# EAGLE design debug_board_1 (EAGLE 9.6.2)
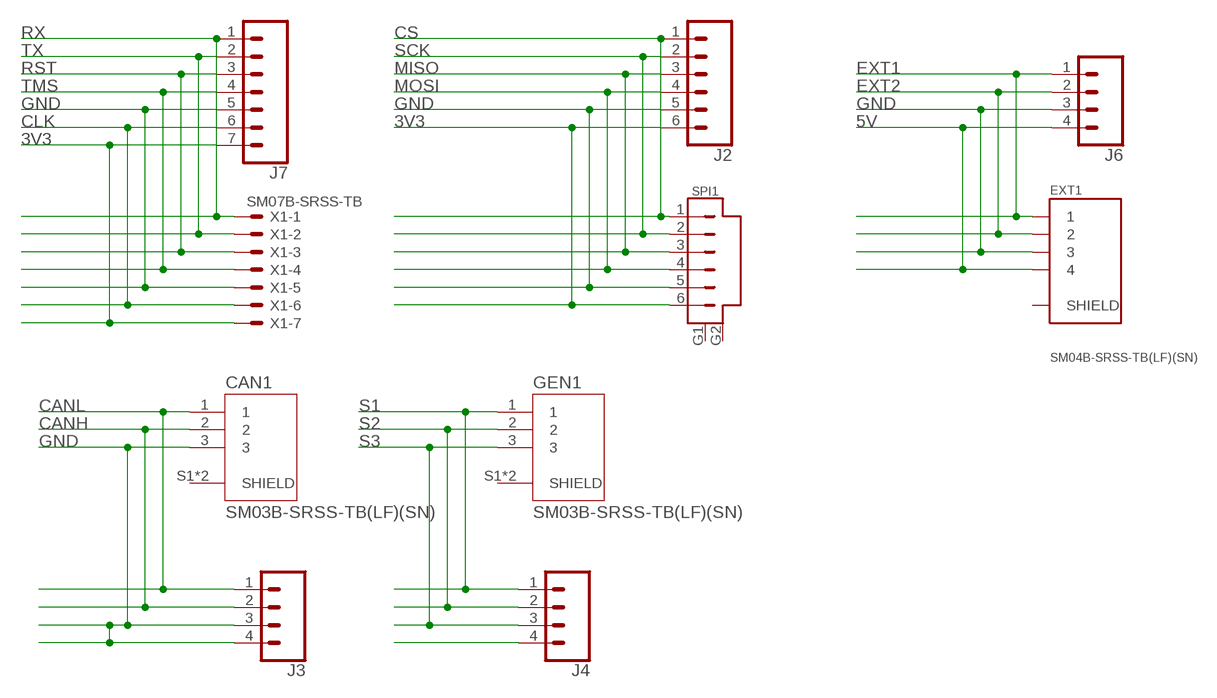
[diagram p0: schematic, sheet 1]

## Parts
CAN1  SM03B-SRSS-TB(LF)(SN)  [JST_SM03B-SRSS-TB(LF)(SN)]
EXT1  SM04B-SRSS-TB(LF)(SN)  [JST_SM04B-SRSS-TB(LF)(SN)]
GEN1  SM03B-SRSS-TB(LF)(SN)  [JST_SM03B-SRSS-TB(LF)(SN)]
J2  CONN_06LONGPADS  [1X06_LONGPADS]
J3  CONN_04LONGPADS  [1X04_LONGPADS]
J4  CONN_04LONGPADS  [1X04_LONGPADS]
J6  CONN_04LONGPADS  [1X04_LONGPADS]
J7  CONN_07LONGPADS  [1X07_LONGPADS]
SPI1  SM06B-SRSS-TB  [SM06B]
X1  SM07B-SRSS-TB  [SM07B-SRSS-TB]

## Nets
3V3: J2.6 J7.7 SPI1.6 X1.7
5V: EXT1.4 J6.4
CANH: CAN1.2 J3.2
CANL: CAN1.1 J3.1
CLK: J7.6 X1.6
CS: J2.1 SPI1.1
EXT1: EXT1.1 J6.1
EXT2: EXT1.2 J6.2
GND: CAN1.3 EXT1.3 J2.5 J3.3 J3.4 J6.3 J7.5 SPI1.5 X1.5
MISO: J2.3 SPI1.3
MOSI: J2.4 SPI1.4
N$45: J4.4
RST: J7.3 X1.3
RX: J7.1 X1.1
S1: GEN1.1 J4.1
S2: GEN1.2 J4.2
S3: GEN1.3 J4.3
SCK: J2.2 SPI1.2
TMS: J7.4 X1.4
TX: J7.2 X1.2
Unconnected: CAN1.S1(SHIELD) CAN1.S2(SHIELD) EXT1.S1(SHIELD) EXT1.S2(SHIELD) GEN1.S1(SHIELD) GEN1.S2(SHIELD) SPI1.G1 SPI1.G2

## Library data of the parts
CAN1 GEN1 = SM03B-SRSS-TB_LF__SN_:SM03B-SRSS-TB(LF)(SN): SH Series 3 Position 1 mm Pitch Surface Mount Side Entry Shrouded Header; AVAILABILITY: Unavailable; DESCRIPTION: Connector Header Surface Mount, Right Angle 3 position 0.039 _1.00mm_; MF: JST Sales; MP: SM03B-SRSS-TB_LF__SN_; PACKAGE: None; PRICE: None
EXT1 = SM04B-SRSS-TB_LF__SN_:SM04B-SRSS-TB(LF)(SN): SH Series 1.0 mm Pitch 2 Position Single Row Side Entry Shrouded Header Check prices <https://snapeda.com/parts/SM04B-SRSS-TB%28LF%29%28SN%29/JST%20Sales/view-part/?ref=eda>; ARROW_EUROPE-PURCHASE-URL: https://snapeda.com/shop?store=Arrow+Europe&id=557466; AVAILABILITY: Good; DESCRIPTION: Connector Header Surface Mount, Right Angle 4 position 0.039 (1.00mm); DIGIKEY-PURCHASE-URL: https://snapeda.com/shop?store=DigiKey&id=557466; MF: JST Sales; MP: SM04B-SRSS-TB(LF)(SN); PACKAGE: None; PRICE: None
J2 = SparkFun-Connectors:CONN_06: Multi connection point. Often used as Generic Header-pin footprint for 0.1 inch spaced/style header connections On any of the 0.1 inch spaced packages, you can populate with these: Break Away Headers - Straight <https://www.sparkfun.com/products/116> (PRT-00116) Break Away Male Headers - Right Angle <https://www.sparkfun.com/products/553> (PRT-00553) Female Headers <https://www.sparkfun.com/products/115> (PRT-00115) Break Away Headers - Machine Pin <https://www.sparkfun.com/products/117> (PRT-00117) Break Away Female Headers - Swiss Machine Pin <https://www.sparkfun.com/products/743> (PRT-00743) Arduino Stackable Header - 6 Pin <https://www.sparkfun.com/products/9280> (PRT-09280) For SCREWTERMINALS and SPRING TERMINALS visit here: Screw Terimnals on SparkFun.com <https://www.sparkfun.com/search/results?term=Screw+Terminals> (5mm/3.5mm/2.54mm spacing) This device is also useful as a general connection point to wire up your design to another part of your project. Our various solder wires solder well into these plated through hole pads. Hook-Up Wire - Assortment (Stranded, 22 AWG) <https://www.sparkfun.com/products/11375> (PRT-11375) Hook-Up Wire - Assortment (Solid Core, 22 AWG) <https://www.sparkfun.com/products/11367> (PRT-11367) View the entire wire category on our website here <https://www.sparkfun.com/categories/141>
J3 J4 J6 = SparkFun-Connectors:CONN_04: Multi connection point. Often used as Generic Header-pin footprint for 0.1 inch spaced/style header connections On any of the 0.1 inch spaced packages, you can populate with these: Break Away Headers - Straight <https://www.sparkfun.com/products/116> (PRT-00116) Break Away Male Headers - Right Angle <https://www.sparkfun.com/products/553> (PRT-00553) Female Headers <https://www.sparkfun.com/products/115> (PRT-00115) Break Away Headers - Machine Pin <https://www.sparkfun.com/products/117> (PRT-00117) Break Away Female Headers - Swiss Machine Pin <https://www.sparkfun.com/products/743> (PRT-00743) For SCREWTERMINALS and SPRING TERMINALS visit here: Screw Terimnals on SparkFun.com <https://www.sparkfun.com/search/results?term=Screw+Terminals> (5mm/3.5mm/2.54mm spacing) This device is also useful as a general connection point to wire up your design to another part of your project. Our various solder wires solder well into these plated through hole pads. Hook-Up Wire - Assortment (Stranded, 22 AWG) <https://www.sparkfun.com/products/11375> (PRT-11375) Hook-Up Wire - Assortment (Solid Core, 22 AWG) <https://www.sparkfun.com/products/11367> (PRT-11367) View the entire wire category on our website here <https://www.sparkfun.com/categories/141> Special notes: Molex polarized connector foot print use with SKU : PRT-08231 with associated crimp pins and housings. 1MM SMD Version SKU: PRT-10208; PROD_ID: CONN-09696
J7 = SparkFun-Connectors:CONN_07: Multi connection point. Often used as Generic Header-pin footprint for 0.1 inch spaced/style header connections On any of the 0.1 inch spaced packages, you can populate with these: Break Away Headers - Straight <https://www.sparkfun.com/products/116> (PRT-00116) Break Away Male Headers - Right Angle <https://www.sparkfun.com/products/553> (PRT-00553) Female Headers <https://www.sparkfun.com/products/115> (PRT-00115) Break Away Headers - Machine Pin <https://www.sparkfun.com/products/117> (PRT-00117) Break Away Female Headers - Swiss Machine Pin <https://www.sparkfun.com/products/743> (PRT-00743) For SCREWTERMINALS and SPRING TERMINALS visit here: Screw Terimnals on SparkFun.com <https://www.sparkfun.com/search/results?term=Screw+Terminals> (5mm/3.5mm/2.54mm spacing) This device is also useful as a general connection point to wire up your design to another part of your project. Our various solder wires solder well into these plated through hole pads. Hook-Up Wire - Assortment (Stranded, 22 AWG) <https://www.sparkfun.com/products/11375> (PRT-11375) Hook-Up Wire - Assortment (Solid Core, 22 AWG) <https://www.sparkfun.com/products/11367> (PRT-11367) View the entire wire category on our website here <https://www.sparkfun.com/categories/141> Special notes: Molex polarized connector foot print use with SKU : PRT-08231 with associated crimp pins and housings. 1MM SMD Version SKU: PRT-10208 NOTES ON THE VARIANTS LOCK and LOCK_LONGPADS... This footprint was designed to help hold the alignment of a through-hole component (i.e. 6-pin header) while soldering it into place. You may notice that each hole has been shifted either up or down by 0.005 of an inch from it's more standard position (which is a perfectly straight line). This slight alteration caused the pins (the squares in the middle) to touch the edges of the holes. Because they are alternating, it causes a "brace" to hold the component in place. 0.005 has proven to be the perfect amount of "off-center" position when using our standard breakaway headers. Although looks a little odd when you look at the bare footprint, once you have a header in there, the alteration is very hard to notice. Also,if you push a header all the way into place, it is covered up entirely on the bottom side.
SPI1 = SM06B-SRSS-TB:SM06B-SRSS-TB: CONN HEADER SH 6POS SIDE 1MM TIN Check prices <https://snapeda.com/parts/SM06B-SRSS-TB/JST%20Sales/view-part/?ref=eda>; AVAILABILITY: Bad; DESCRIPTION: Connector Header Surface Mount, Right Angle 6 position 0.039 (1.00mm); MF: JST Sales; MP: SM06B-SRSS-TB; PACKAGE: None; PRICE: None
X1 = con-jst2:?M07B-SRSS-TB: Disconnectable Crimp style connector, 1.0mm pitch 7 contacts

## Board
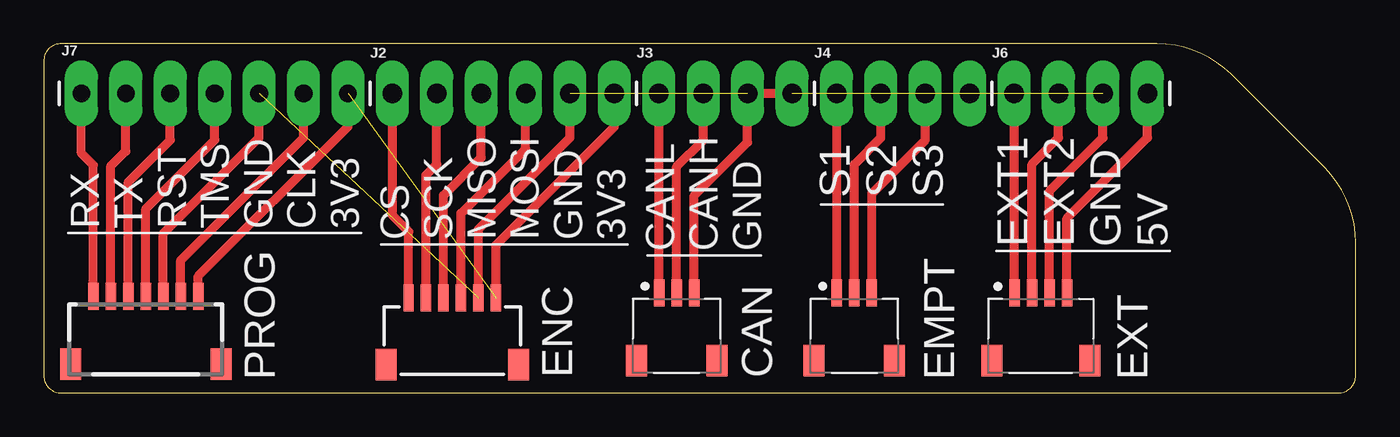
[diagram p1: board, top side]
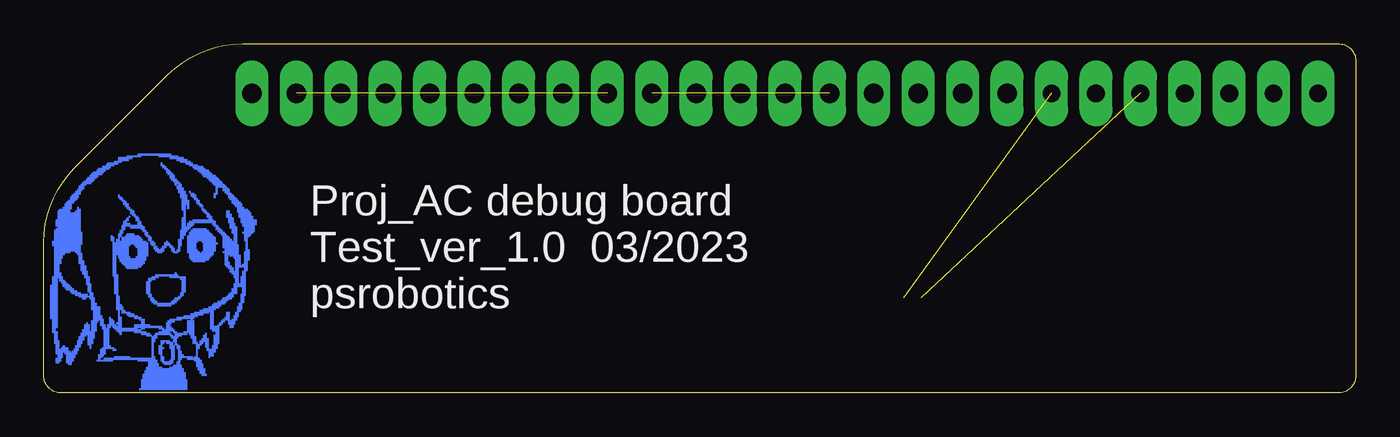
[diagram p2: board, bottom side, seen from below]

Size 75.04 x 19.99 mm. Coordinates in mm from the lower left corner, seen from the top.
Outline: 0,18.99 0,1 arc90 1,0 74.04,0 arc90 75.04,1 75.04,8.62 arc45 73.28,12.86 67.9,18.23 arc45 63.66,19.99 1,19.99 arc90 0,18.99
Copper layers (1*16): Top 0.035mm / dielectric 1.5mm / Bottom 0.035mm
Design rules "default *": minimum track width 6mil, minimum drill 0.35mm, track to track 6mil, track to pad 6mil, pad to pad 6mil, via to via 6mil, smd to smd 6mil, copper to edge 6mil, drill to drill 6mil, minimum pad ring 10mil, minimum via ring 8mil, stop-mask expansion 4mil, vias tented up to drill 12mil, thermal gap 10mil

### Footprints (pad centres in the part's own frame; a part is rotated, then mirrored left to right if it is on the bottom)
JST_SM03B-SRSS-TB(LF)(SN) = smd 0.6 x 1.55: 1 -1,0; 2 0,0; 3 1,0 | smd 1.2 x 1.8: S1 -2.3,-3.875; S2 2.3,-3.875
JST_SM04B-SRSS-TB(LF)(SN) = smd 0.6 x 1.55: 1 -1.5,0; 2 -0.5,0; 3 0.5,0; 4 1.5,0 | smd 1.2 x 1.8: S1 -2.8,-3.875; S2 2.8,-3.875
1X06_LONGPADS = drill 1.118 pad 1.88 long: 1 0,0; 2 2.54,0; 3 5.08,0; 4 7.62,0; 5 10.16,0; 6 12.7,0
1X04_LONGPADS = drill 1.118 pad 1.88 long: 1 0,0; 2 2.54,0; 3 5.08,0; 4 7.62,0
1X07_LONGPADS = drill 1.016 pad 1.88 long: 1 0,0; 2 2.54,0; 3 5.08,0; 4 7.62,0; 5 10.16,0; 6 12.7,0; 7 15.24,0
SM06B = smd 0.6 x 1.55: 1 -2.5,2.275; 2 -1.5,2.275; 3 -0.5,2.275; 4 0.5,2.275; 5 1.5,2.275; 6 2.5,2.275 | smd 1.2 x 1.8: G1 -3.8,-1.55; G2 3.8,-1.55
SM07B-SRSS-TB = smd 0.6 x 1.55: 1 -3,2.975; 2 -2,2.975; 3 -1,2.975; 4 0,2.975; 5 1,2.975; 6 2,2.975; 7 3,2.975 | smd 1.2 x 1.8: FIT@1 -4.3,-0.9; FIT@2 4.3,-0.9

### Placement (x,y rotation side)
CAN1  36.2,5.71 0 top
EXT1  57.02,5.71 0 top
GEN1  46.35,5.71 0 top
J2  19.94,17.14 0 top
J3  35.18,17.14 0 top
J4  45.34,17.14 0 top
J6  55.5,17.14 0 top
J7  2.16,17.14 0 top
SPI1  23.37,3.17 0 top
U$1  [SODAYO_1]  61.59,0.13 0 top
X1  5.84,2.54 0 top

### Tracks (layer width: path | path; a pad name or v marks a point on that pad's centre or on a via)
3V3  (1 unrouted)
  Top 0.508: X1.7 8.84,6.68 17.4,15.24 J7.7 | SPI1.6 25.87,8.47 32.64,15.24 J2.6
5V
  Top 0.508: EXT1.4 58.52,10.01 63.12,14.61 J6.4
CANH
  Top 0.508: CAN1.2 36.2,12.95 37.72,14.48 J3.2
CANL
  Top 0.508: CAN1.1 35.2,17.13 J3.1
CLK
  Top 0.508: X1.6 7.84,7.59 14.86,14.61 J7.6
CS
  Top 0.508: SPI1.1 20.87,9.23 19.94,10.16 J2.1
EXT1
  Top 0.508: EXT1.1 55.52,17.12 J6.1
EXT2
  Top 0.508: EXT1.2 56.52,13.09 58.04,14.61 J6.2
GND  (3 unrouted)
  Top 0.508: X1.5 6.84,9.13 12.32,14.61 J7.5 | SPI1.5 24.87,9.37 30.1,14.61 J2.5 | CAN1.3 37.2,11.29 40.26,14.35 J3.3 J3.4 | EXT1.3 57.52,11.55 60.58,14.61 J6.3
MISO
  Top 0.508: SPI1.3 22.87,11.31 25.02,13.46 J2.3
MOSI
  Top 0.508: SPI1.4 23.87,10.28 27.56,13.97 J2.4
RST
  Top 0.508: X1.3 4.84,12.08 7.24,14.48 J7.3
RX
  Top 0.508: X1.1 2.84,13.03 2.16,13.72 J7.1
S1
  Top 0.508: GEN1.1 45.35,17.13 J4.1
S2
  Top 0.508: GEN1.2 46.35,13.08 47.88,14.61 J4.2
S3
  Top 0.508: GEN1.3 47.35,11.41 50.42,14.48 J4.3
SCK
  Top 0.508: SPI1.2 21.87,12.47 22.48,13.08 J2.2
TMS
  Top 0.508: X1.4 5.84,10.54 9.78,14.48 J7.4
TX
  Top 0.508: X1.2 3.84,12.99 4.7,13.84 J7.2

### Text on the board
tPlace: S1 / S2 / S3 | RX / TX / RST / TMS / GND / CLK / 3V3 | CS / SCK / MISO / MOSI / GND / 3V3 | CANL / CANH / GND | EXT1 / EXT2 / GND / 5V | PROG | ENC | CAN | EMPT | EXT
bPlace: Proj_AC debug board / Test_ver_1.0 03/2023 / psrobotics
tStop: Proj_AC / Shaung